# Altium schematic sheet audio_amp.SchDoc
size A4
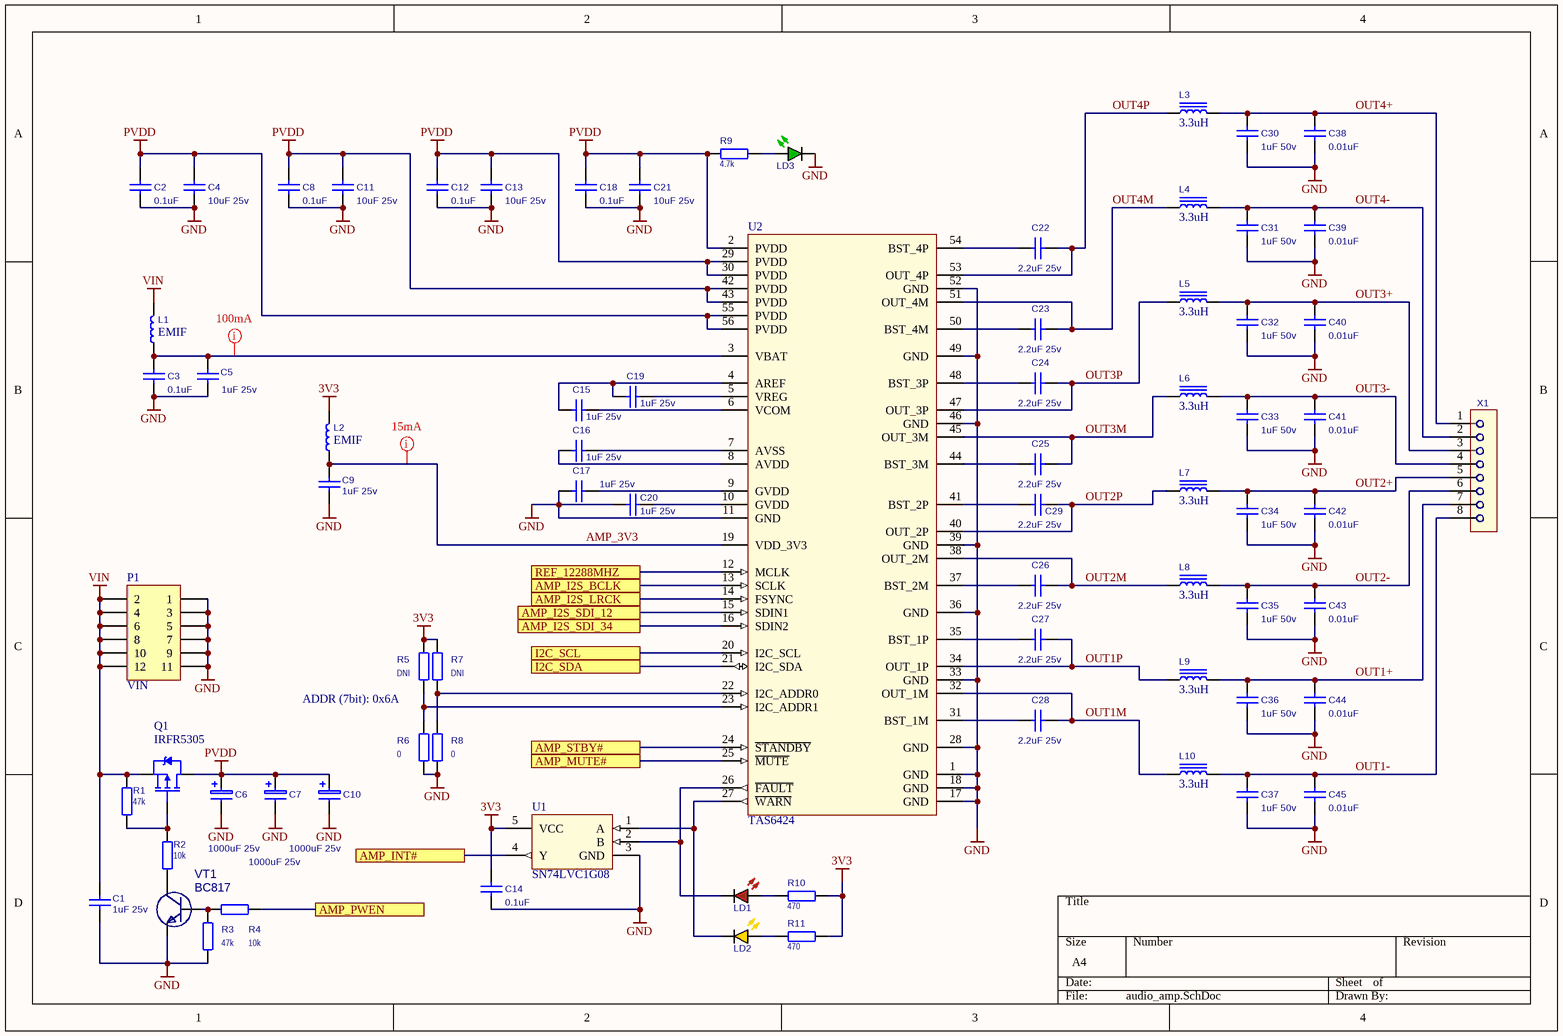
[diagram p0: audio_amp.SchDoc]

## Parts
C1  value 1uF 25v  [C0603]  (hidden comment: GRM188R61E105KA12D)
C2  value 0.1uF  [C0603]  (hidden comment: CC0603KRX7R9BB104)
C3  value 0.1uF  [C0603]  (hidden comment: CC0603KRX7R9BB104)
C4  value 10uF 25v  [C0805]  (hidden comment: GRM21BR61E106KA73L)
C5  value 1uF 25v  [C0603]  (hidden comment: GRM188R61E105KA12D)
C6  value 1000uF 25v  [R12H05]  (hidden comment: EEUFM1E102)
C7  value 1000uF 25v  [R12H05]  (hidden comment: EEUFM1E102)
C8  value 0.1uF  [C0603]  (hidden comment: CC0603KRX7R9BB104)
C9  value 1uF 25v  [C0603]  (hidden comment: GRM188R61E105KA12D)
C10  value 1000uF 25v  [R12H05]  (hidden comment: EEUFM1E102)
C11  value 10uF 25v  [C0805]  (hidden comment: GRM21BR61E106KA73L)
C12  value 0.1uF  [C0603]  (hidden comment: CC0603KRX7R9BB104)
C13  value 10uF 25v  [C0805]  (hidden comment: GRM21BR61E106KA73L)
C14  value 0.1uF  [C0603]  (hidden comment: CC0603KRX7R9BB104)
C15  value 1uF 25v  [C0603]  (hidden comment: GRM188R61E105KA12D)
C16  value 1uF 25v  [C0603]  (hidden comment: GRM188R61E105KA12D)
C17  value 1uF 25v  [C0603]  (hidden comment: GRM188R61E105KA12D)
C18  value 0.1uF  [C0603]  (hidden comment: CC0603KRX7R9BB104)
C19  value 1uF 25v  [C0603]  (hidden comment: GRM188R61E105KA12D)
C20  value 1uF 25v  [C0603]  (hidden comment: GRM188R61E105KA12D)
C21  value 10uF 25v  [C0805]  (hidden comment: GRM21BR61E106KA73L)
C22  value 2.2uF 25v  [C0603]  (hidden comment: CL10A225KA8NNNC)
C23  value 2.2uF 25v  [C0603]  (hidden comment: CL10A225KA8NNNC)
C24  value 2.2uF 25v  [C0603]  (hidden comment: CL10A225KA8NNNC)
C25  value 2.2uF 25v  [C0603]  (hidden comment: CL10A225KA8NNNC)
C26  value 2.2uF 25v  [C0603]  (hidden comment: CL10A225KA8NNNC)
C27  value 2.2uF 25v  [C0603]  (hidden comment: CL10A225KA8NNNC)
C28  value 2.2uF 25v  [C0603]  (hidden comment: CL10A225KA8NNNC)
C29  value 2.2uF 25v  [C0603]  (hidden comment: CL10A225KA8NNNC)
C30  value 1uF 50v  [C0603]  (hidden comment: CL10A105KB8NNNC)
C31  value 1uF 50v  [C0603]  (hidden comment: CL10A105KB8NNNC)
C32  value 1uF 50v  [C0603]  (hidden comment: CL10A105KB8NNNC)
C33  value 1uF 50v  [C0603]  (hidden comment: CL10A105KB8NNNC)
C34  value 1uF 50v  [C0603]  (hidden comment: CL10A105KB8NNNC)
C35  value 1uF 50v  [C0603]  (hidden comment: CL10A105KB8NNNC)
C36  value 1uF 50v  [C0603]  (hidden comment: CL10A105KB8NNNC)
C37  value 1uF 50v  [C0603]  (hidden comment: CL10A105KB8NNNC)
C38  value 0.01uF  [C0603]  (hidden comment: CL10B103KB8NNNC)
C39  value 0.01uF  [C0603]  (hidden comment: CL10B103KB8NNNC)
C40  value 0.01uF  [C0603]  (hidden comment: CL10B103KB8NNNC)
C41  value 0.01uF  [C0603]  (hidden comment: CL10B103KB8NNNC)
C42  value 0.01uF  [C0603]  (hidden comment: CL10B103KB8NNNC)
C43  value 0.01uF  [C0603]  (hidden comment: CL10B103KB8NNNC)
C44  value 0.01uF  [C0603]  (hidden comment: CL10B103KB8NNNC)
C45  value 0.01uF  [C0603]  (hidden comment: CL10B103KB8NNNC)
L1  value EMIF  [IND0603]  (hidden comment: BLM18AG102SN1D)
L2  value EMIF  [IND0603]  (hidden comment: BLM18AG102SN1D)
L3  value 3.3uH  [IHLP-2525CZ]  (hidden comment: IHLP2525CZER3R3M01)
L4  value 3.3uH  [IHLP-2525CZ]  (hidden comment: IHLP2525CZER3R3M01)
L5  value 3.3uH  [IHLP-2525CZ]  (hidden comment: IHLP2525CZER3R3M01)
L6  value 3.3uH  [IHLP-2525CZ]  (hidden comment: IHLP2525CZER3R3M01)
L7  value 3.3uH  [IHLP-2525CZ]  (hidden comment: IHLP2525CZER3R3M01)
L8  value 3.3uH  [IHLP-2525CZ]  (hidden comment: IHLP2525CZER3R3M01)
L9  value 3.3uH  [IHLP-2525CZ]  (hidden comment: IHLP2525CZER3R3M01)
L10  value 3.3uH  [IHLP-2525CZ]  (hidden comment: IHLP2525CZER3R3M01)
LD1  LED_R  [R0603]  (value not drawn)
LD2  LED_Y  [R0603]  (value not drawn)
LD3  LED_G  [R0603]  (value not drawn)
P1  VIN  [PLD-6]
Q1  IRFR5305  [D-PAK]
R1  47k  [R0603]
R2  10k  [R0603]
R3  47k  [R0603]
R4  10k  [R0603]
R5  value DNI  [R0603]  (hidden comment: 47k)
R6  value 0  [R0603]  (hidden comment: 47k)
R7  value DNI  [R0603]  (hidden comment: 47k)
R8  value 0  [R0603]  (hidden comment: 47k)
R9  4.7k  [R0603]
R10  470  [R0603]
R11  470  [R0603]
U1  value SN74LVC1G08  [SOT-23-5]  (hidden comment: SN74LVC1G08DBVR)
U2  TAS6424  [HSSOP-56]
VT1  BC817  [SOT-23-3]
X1  DGxxx-8  [DG126-5.0-8P]  (value not drawn)

## Ports
AMP_I2S_BCLK, AMP_I2S_LRCK, AMP_I2S_SDI_12, AMP_I2S_SDI_34, AMP_INT#, AMP_MUTE#, AMP_PWEN, AMP_STBY#, I2C_SCL, I2C_SDA, REF_12288MHZ

## Nets
3V3: C14.1 L2.2 R5.1 R7.1 R10.1 R11.1 U1.5(VCC)
GND: C1.1 C2.2 C3.2 C4.2 C5.1 C6.2(-) C7.2(-) C8.2 C9.1 C10.2(-) C11.2 C12.2 C13.2 C14.2 C17.1 C18.2 C20.1 C21.2 C30.2 C31.2 C32.2 C33.2 C34.2 C35.2 C36.2 C37.2 C38.2 C39.2 C40.2 C41.2 C42.2 C43.2 C44.2 C45.2 LD3.1 P1.1 P1.3 P1.5 P1.7 P1.9 P1.11 R3.1 R6.2 R8.2 U1.3(GND) U2.1(GND) U2.11(GND) U2.17(GND) U2.18(GND) U2.28(GND) U2.33(GND) U2.36(GND) U2.39(GND) U2.46(GND) U2.49(GND) U2.52(GND) VT1.2
PVDD: C2.1 C4.1 C6.1(+) C7.1(+) C8.1 C10.1(+) C11.1 C12.1 C13.1 C18.1 C21.1 Q1.2(D) R9.1 U2.2(PVDD) U2.29(PVDD) U2.30(PVDD) U2.42(PVDD) U2.43(PVDD) U2.55(PVDD) U2.56(PVDD)
VIN: C1.2 L1.2 P1.2 P1.4 P1.6 P1.8 P1.10 P1.12 Q1.3(S) R1.1
AMP_3V3: C9.2 L2.1 U2.19(VDD_3V3)
AMP_I2S_BCLK: U2.13(SCLK) ; port AMP_I2S_BCLK
AMP_I2S_LRCK: U2.14(FSYNC) ; port AMP_I2S_LRCK
AMP_I2S_SDI_12: U2.15(SDIN1) ; port AMP_I2S_SDI_12
AMP_I2S_SDI_34: U2.16(SDIN2) ; port AMP_I2S_SDI_34
AMP_INT#: U1.4(Y) ; port AMP_INT#
AMP_MUTE#: U2.25(~{MUTE}) ; port AMP_MUTE#
AMP_PWEN: R4.1 ; port AMP_PWEN
AMP_STBY#: U2.24(~{STANDBY}) ; port AMP_STBY#
I2C_SCL: U2.20(I2C_SCL) ; port I2C_SCL
I2C_SDA: U2.21(I2C_SDA) ; port I2C_SDA
OUT1+: C36.1 C44.1 L9.2 X1.7
OUT1-: C37.1 C45.1 L10.2 X1.8
OUT1M: C28.1 L10.1 U2.32(OUT_1M)
OUT1P: C27.1 L9.1 U2.34(OUT_1P)
OUT2+: C34.1 C42.1 L7.2 X1.5
OUT2-: C35.1 C43.1 L8.2 X1.6
OUT2M: C26.1 L8.1 U2.38(OUT_2M)
OUT2P: C29.1 L7.1 U2.40(OUT_2P)
OUT3+: C32.1 C40.1 L5.2 X1.3
OUT3-: C33.1 C41.1 L6.2 X1.4
OUT3M: C25.1 L6.1 U2.45(OUT_3M)
OUT3P: C24.1 L5.1 U2.47(OUT_3P)
OUT4+: C30.1 C38.1 L3.2 X1.1
OUT4-: C31.1 C39.1 L4.1 X1.2
OUT4M: C23.1 L4.2 U2.51(OUT_4M)
OUT4P: C22.1 L3.1 U2.53(OUT_4P)
REF_12288MHZ: U2.12(MCLK) ; port REF_12288MHZ
NetC3_1: C3.1 C5.2 L1.1 U2.3(VBAT)
NetC15_1: C15.1 U2.6(VCOM)
NetC15_2: C15.2 C19.2 U2.4(AREF)
NetC16_1: C16.1 U2.8(AVDD)
NetC16_2: C16.2 U2.7(AVSS)
NetC17_2: C17.2 U2.9(GVDD)
NetC19_1: C19.1 U2.5(VREG)
NetC20_2: C20.2 U2.10(GVDD)
NetC22_2: C22.2 U2.54(BST_4P)
NetC23_2: C23.2 U2.50(BST_4M)
NetC24_2: C24.2 U2.48(BST_3P)
NetC25_2: C25.2 U2.44(BST_3M)
NetC26_2: C26.2 U2.37(BST_2M)
NetC27_2: C27.2 U2.35(BST_1P)
NetC28_2: C28.2 U2.31(BST_1M)
NetC29_2: C29.2 U2.41(BST_2P)
NetLD1_1: LD1.1 U1.2(B) U2.26(~{FAULT})
NetLD1_2: LD1.2 R10.2
NetLD2_1: LD2.1 U1.1(A) U2.27(~{WARN})
NetLD2_2: LD2.2 R11.2
NetLD3_2: LD3.2 R9.2
NetQ1_1: Q1.1(G) R1.2 R2.2
NetR2_1: R2.1 VT1.3
NetR3_2: R3.2 R4.2 VT1.1
NetR5_2: R5.2 R6.1 U2.23(I2C_ADDR1)
NetR7_2: R7.2 R8.1 U2.22(I2C_ADDR0)

## Layout directives
mark named 15mA: AMP_3V3
mark named 100mA: NetC3_1

## Notes on the sheet
- ADDR (7bit): 0x6A

## Library data of the parts
C1-C5 C8 C9 C11-C45 = CAP_NPOL
C6 C7 C10 = CAP_POL
L1 L2 = IND_WO_IRON
L3-L10 = IND_W_IRON
LD1 = LED_RED: LED Red; Value: *
LD2 = LED_YELLOW: LED Yellow; Value: *
LD3 = LED_GREEN: LED Green; Value: *
P1 = HDR 6X2: Header, 6-Pin, Dual row; LatestRevisionDate: 17-Jul-2002; LatestRevisionNote: Re-released for DXP Platform.; Publisher: Altium Limited
Q1 = P-Channel: HEXFET Power MOSFET
R1-R11 = RESISTOR: RES
  R1 R3: Value: 47k
  R2 R4: Value: 10k
  R9: Value: 4.7k
  R10 R11: Value: 470
U1 = SN74LVC1G08
U2 = TAS6424: 75-W, 2-MHz Digital Input 4-Channel Automotive Class-D Audio Amplifier  With Load-Dump Protection and I  2C Diagnostics; value: TAS6424
VT1 = N-P-N: Bipolar transistor N-P-N; Value: BC817
X1 = DGxxx-8: PCB terminal block; Value: *